# EAGLE design esparducam (EAGLE 6.5.0)
CNAME: A two component webcam; CREVISION: 1; DESIGNER: Johan Kanflo
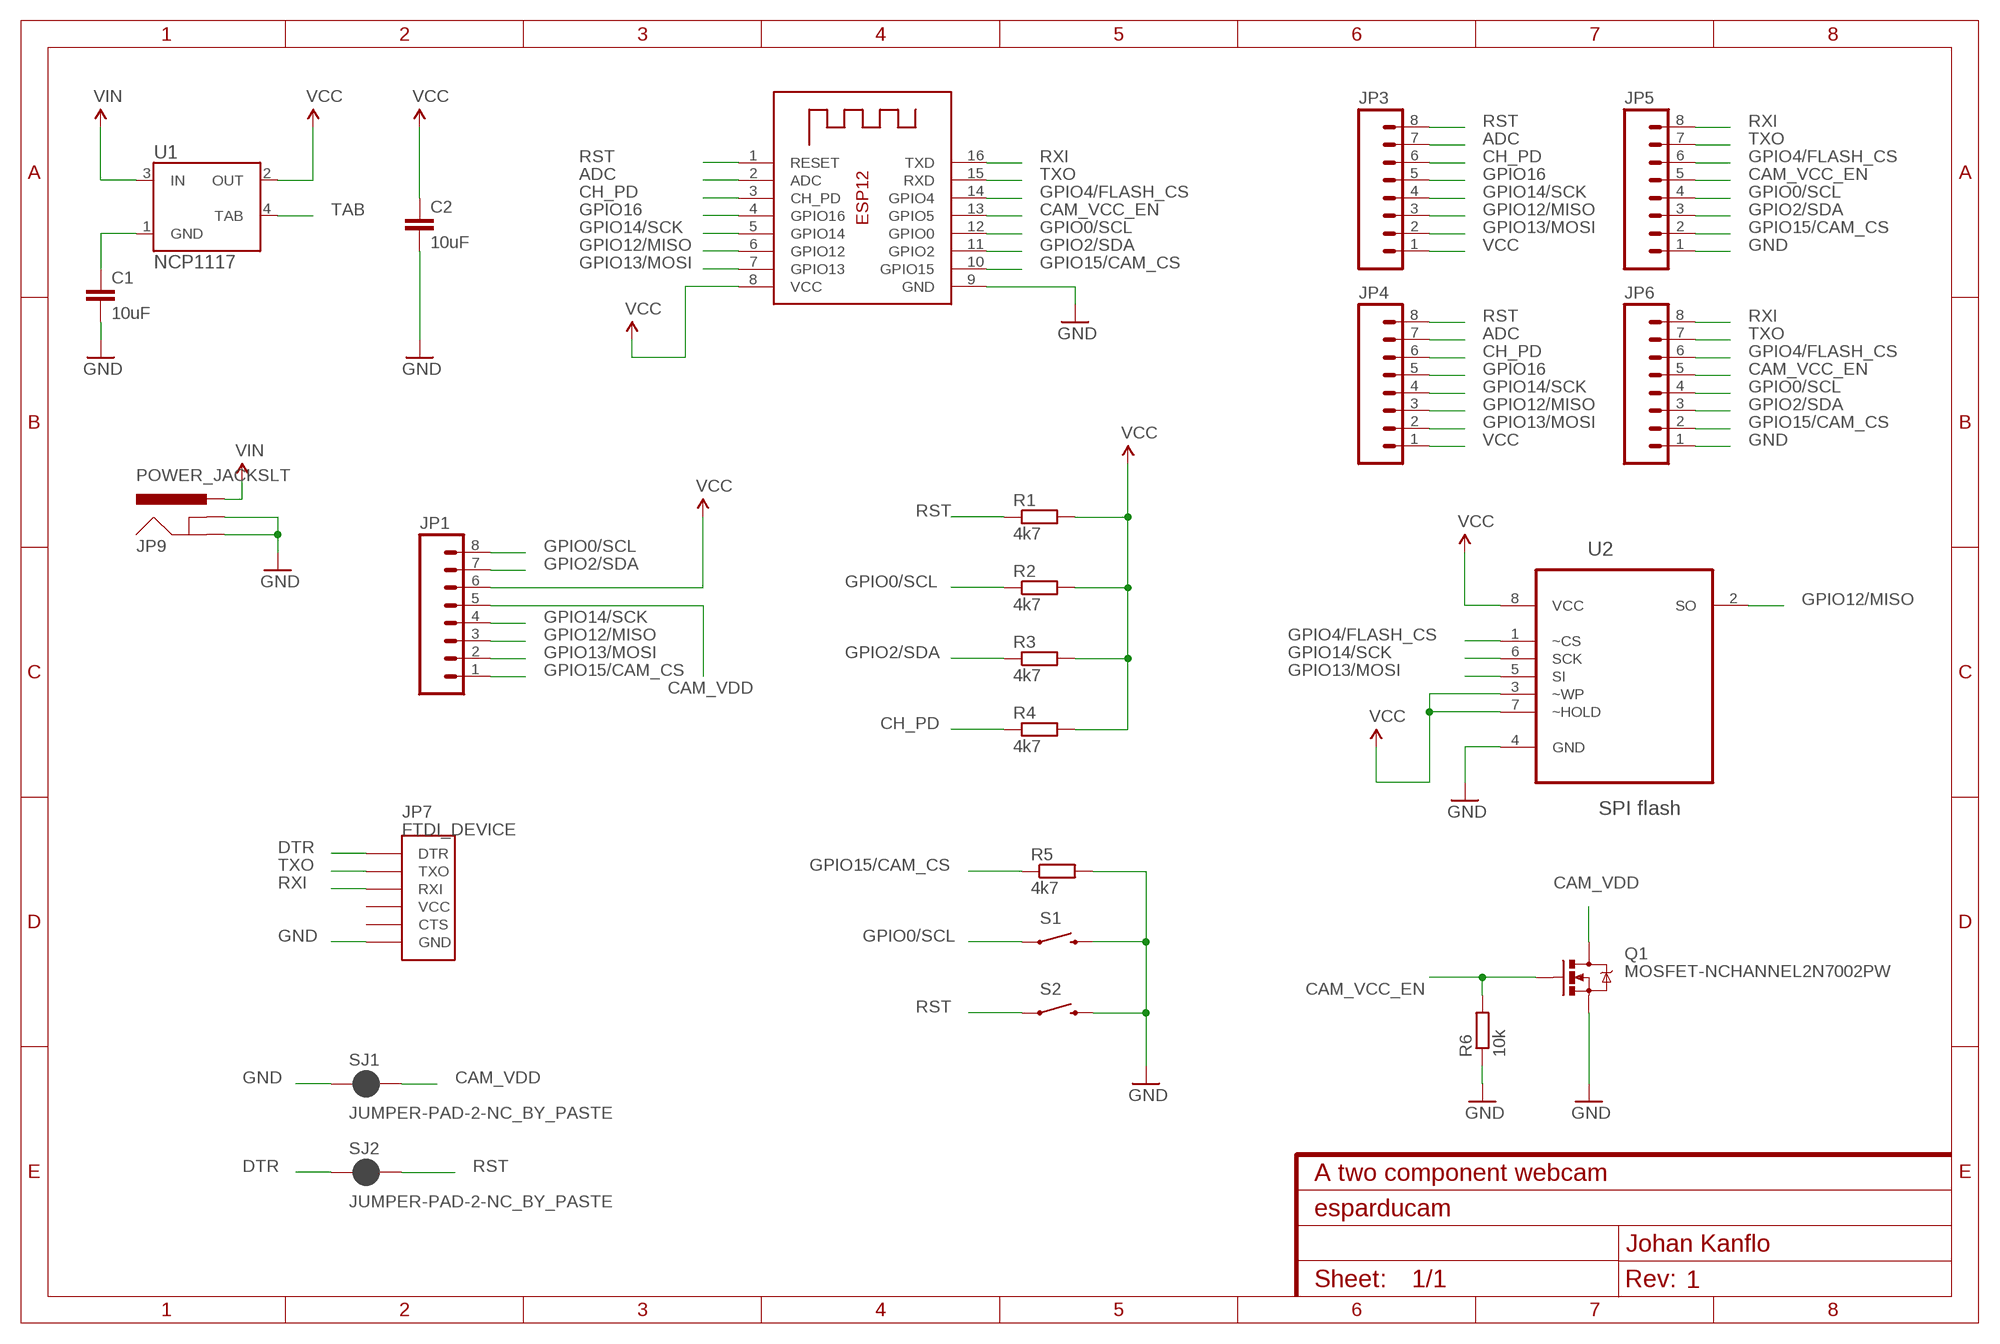
[diagram p0: schematic, sheet 1]

## Parts
C1  10uF  CAP0603-CAP  [0603-CAP]
C2  10uF  CAP0603-CAP  [0603-CAP]
JP1  M08  [1X08_ROUND]
JP3  M08  [1X08_ROUND]
JP4  M08  [1X08_ROUND]
JP5  M08  [1X08_ROUND]
JP6  M08  [1X08_ROUND]
JP7  FTDI_DEVICE  [FTDI_DEVICE_SIDE]
JP9  POWER_JACKSLT  [POWER_JACK_SLOT]
Q1  MOSFET-NCHANNEL2N7002PW  [SOT323]
R1  4k7  R-EU_R0603  [R0603]
R2  4k7  R-EU_R0603  [R0603]
R3  4k7  R-EU_R0603  [R0603]
R4  4k7  R-EU_R0603  [R0603]
R5  4k7  R-EU_R0603  [R0603]
R6  10k  R-EU_R0603  [R0603]
S1  SWITCH-MOMENTARY-2SMD-1101NE  [TACTILE-SWITCH-1101NE]
S2  SWITCH-MOMENTARY-2SMD-1101NE  [TACTILE-SWITCH-1101NE]
SJ1  JUMPER-PAD-2-NC_BY_PASTE  [PAD-JUMPER-2-NC_BY_PASTE_YES_SILK]
SJ2  JUMPER-PAD-2-NC_BY_PASTE  [PAD-JUMPER-2-NC_BY_PASTE_YES_SILK]
U1  NCP1117  [SOT223]
U2  SPI flash  AT25DF021-SSH-B  [SOIC127P600X175-8N]
X1  ESP-12  [ESP-12]

## Nets
ADC: JP3.7 JP4.7 X1.2(ADC)
CAM_VCC_EN: JP5.5 JP6.5 Q1.1(G) R6.2 X1.13(GPIO5)
CAM_VDD: JP1.5 Q1.3(D) SJ1.2
CH_PD: JP3.6 JP4.6 R4.1 X1.3(CH_PD)
DTR: JP7.P$1(DTR) SJ2.1
GND: C1.2 C2.2 JP5.1 JP6.1 JP7.P$6(GND) JP9.GND@1(GNDBREAK) JP9.GND@2(GND) Q1.2(S) R5.2 R6.1 S1.2 S2.2 SJ1.1 U2.4(GND) X1.9(GND)
GPIO0/SCL: JP1.8 JP5.4 JP6.4 R2.1 S1.1 X1.12(GPIO0)
GPIO2/SDA: JP1.7 JP5.3 JP6.3 R3.1 X1.11(GPIO2)
GPIO4/FLASH_CS: JP5.6 JP6.6 U2.1(~CS) X1.14(GPIO4)
GPIO12/MISO: JP1.3 JP3.3 JP4.3 U2.2(SO) X1.6(GPIO12)
GPIO13/MOSI: JP1.2 JP3.2 JP4.2 U2.5(SI) X1.7(GPIO13)
GPIO14/SCK: JP1.4 JP3.4 JP4.4 U2.6(SCK) X1.5(GPIO14)
GPIO15/CAM_CS: JP1.1 JP5.2 JP6.2 R5.1 X1.10(GPIO15)
GPIO16: JP3.5 JP4.5 X1.4(GPIO16)
N$11: C1.1 U1.1(GND)
RST: JP3.8 JP4.8 R1.1 S2.1 SJ2.2 X1.1(RESET)
RXI: JP5.8 JP6.8 JP7.P$3(RXI) X1.16(TXD)
TAB: U1.4(TAB)
TXO: JP5.7 JP6.7 JP7.P$2(TXO) X1.15(RXD)
VCC: C2.1 JP1.6 JP3.1 JP4.1 R1.2 R2.2 R3.2 R4.2 U1.2(OUT) U2.3(~WP) U2.7(~HOLD) U2.8(VCC) X1.8(VCC)
VIN: JP9.PWR U1.3(IN)
Unconnected: JP7.P$4(VCC) JP7.P$5(CTS)

## Library data of the parts
C1 C2 = SparkFun-Capacitors:CAP: Capacitor Standard 0603 ceramic capacitor, and 0.1" leaded capacitor.
JP1 JP3-JP6 = SparkFun-Connectors:M08: Header 8 Standard 8-pin 0.1" header. Use with straight break away headers (SKU : PRT-00116), right angle break away headers (PRT-00553), swiss pins (PRT-00743), machine pins (PRT-00117), and female headers (PRT-00115).
JP7 = SparkFun-Connectors:FTDI_DEVICE: Connector which mates to FTDI basic or FTDI cable.
JP9 = SparkFun-Connectors:POWER_JACK: Power Jack This is the standard 5.5mm barrel jack for power. The PTH is the most common, proven, reliable, footprint. The Slot footprint only works if the mill layer is transmitted to the PCB fab house so be warned. Mating wall wart : TOL-00298 (and others); PROD_ID: PRT-00119
Q1 = SparkFun-DiscreteSemi:MOSFET-NCHANNEL: Common NMOSFET Parts MFG P/N Store ID Prod ID FDD8780 TRANS-09984 SI7820DN TRANS-11055 FDS6630A IC-08089 2N7002PW TRANS-11151 FQP30N06L COM-10213 TRANS-10060 BSS123LT1G TRANS-08345 BSS138 TRANS-00830 BS170 2N7000; PROD_ID: TRANS-11151
R1-R6 = resistor:R-EU_: RESISTOR, European symbol
S1 S2 = SparkFun-Electromechanical:SWITCH-MOMENTARY-2: Various NO switches- pushbuttons, reed, etc; PROD_ID: SWCH-00815
SJ1 SJ2 = SparkFun-Passives:JUMPER-PAD-2-NC_BY_PASTE
U1 = ELL-i-PowerIC:NCP1117
U2 = Atmel_By_element14_Batch_1-00:AT25DF021-SSH-B: 2-Megabit Minimum SPI Serial Flash Memory; MPN: AT25DF021-SSH-B; OC_FARNELL: 1715438; OC_NEWARK: 15R0303; PACKAGE: SOIC-8; SUPPLIER: Atmel
X1 = adafruit:ESP-12

## Board
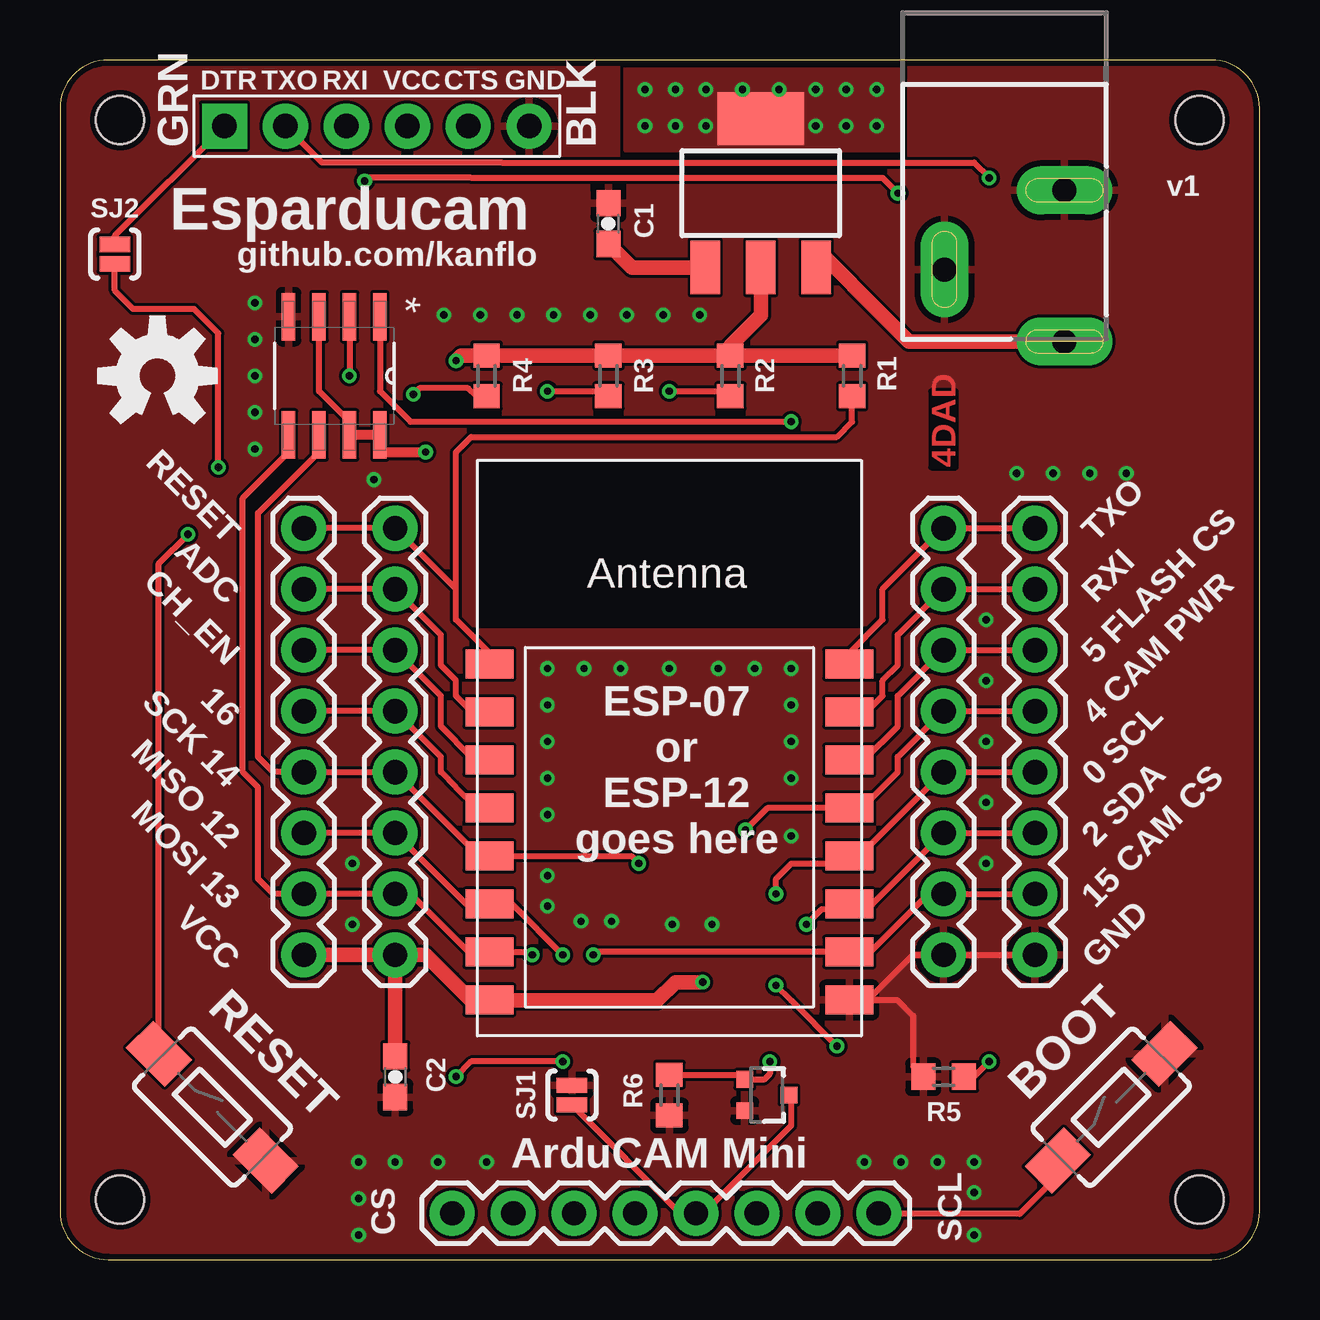
[diagram p1: board, top side]
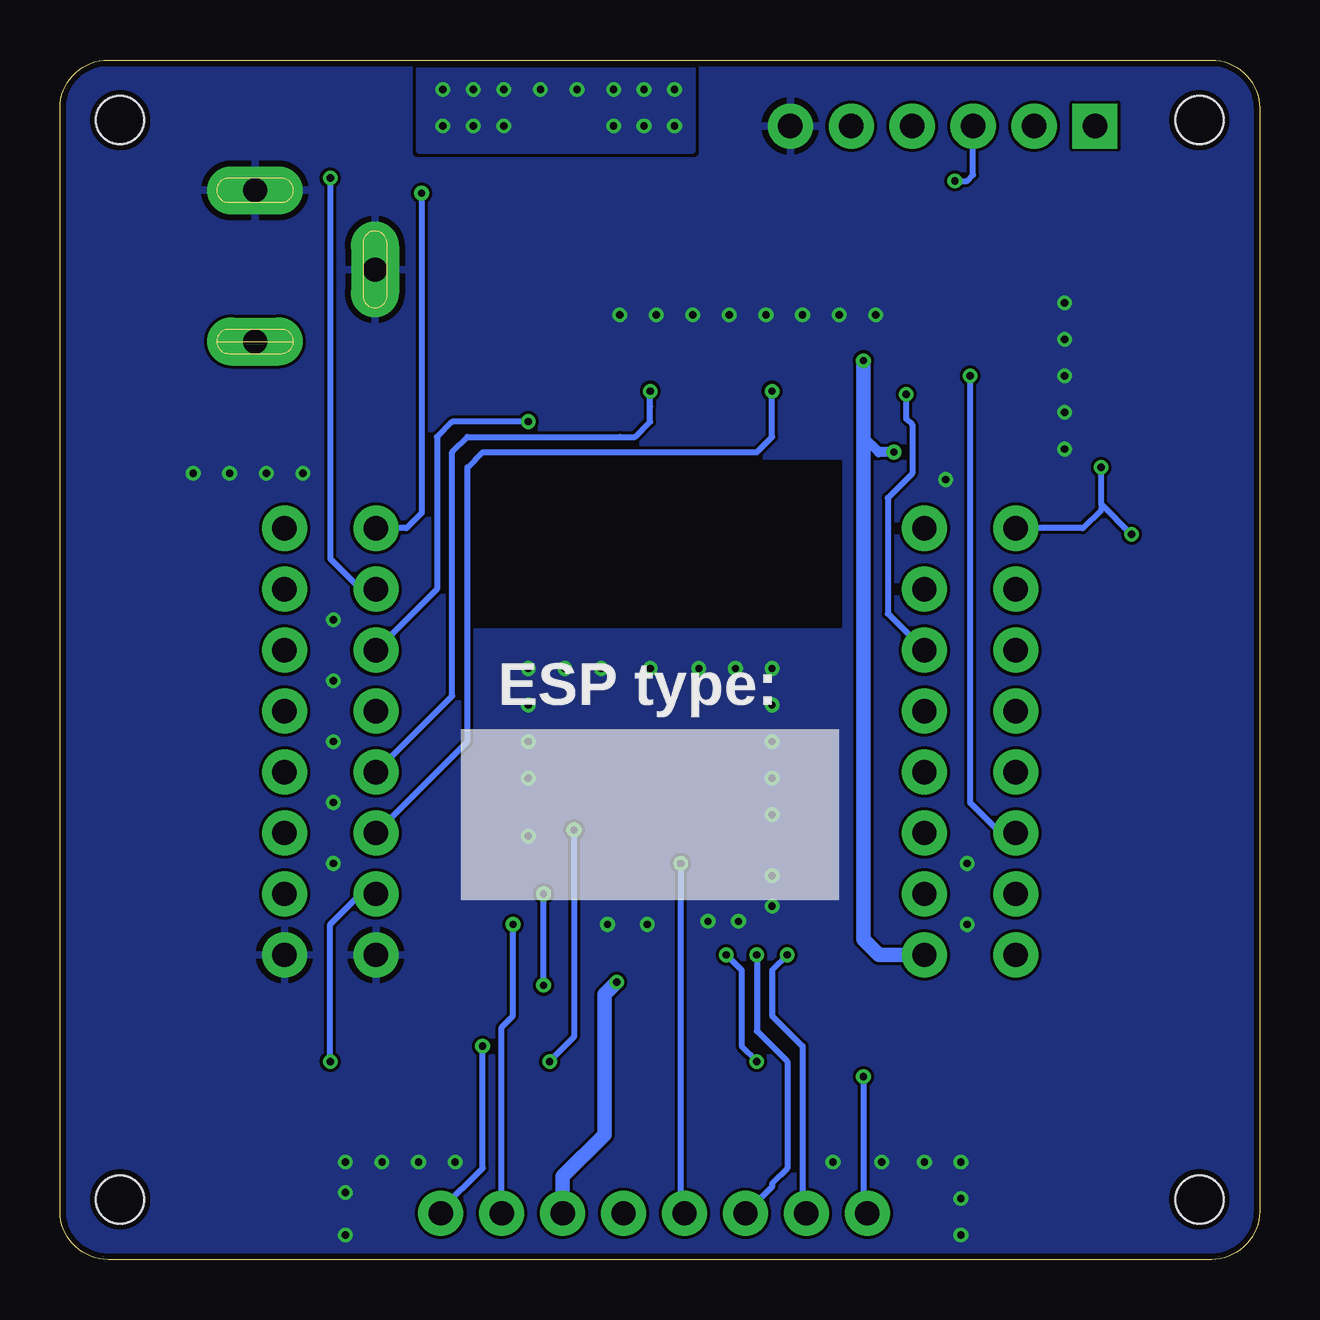
[diagram p2: board, bottom side, seen from below]

Size 50 x 50 mm. Coordinates in mm from the lower left corner, seen from the top.
Outline: 50,2 50,48 arc90 48,50 2,50 arc90 0,48 0,2 arc90 2,0 48,0 arc90 50,2
Copper layers (1*16): Top 0.035mm / dielectric 1.5mm / Bottom 0.035mm
Design rules "dirt_cheap_dirty_boards.v1": minimum track width 5mil, minimum drill 12mil, track to track 5mil, track to pad 5mil, pad to pad 5mil, via to via 5mil, smd to smd 0mil, copper to edge 10mil, drill to drill 10mil, minimum pad ring 10mil, minimum via ring 6mil, stop-mask expansion 2mil, vias tented up to drill 25mil, thermal gap 10mil
Holes 2 mm at 47.49,47.49 47.49,2.51 2.51,2.51 2.51,47.49

### Footprints (pad centres in the part's own frame; a part is rotated, then mirrored left to right if it is on the bottom)
0603-CAP = smd 1.1 x 1: 1 -0.85,0; 2 0.85,0
1X08_ROUND = drill 1.016 pad 1.88: 1 0,0; 2 2.54,0; 3 5.08,0; 4 7.62,0; 5 10.16,0; 6 12.7,0; 7 15.24,0; 8 17.78,0
FTDI_DEVICE_SIDE = drill 1.016 pad 1.88 square: P$1 -6.35,0 | drill 1.016 pad 1.88: P$2 -3.81,0; P$3 -1.27,0; P$4 1.27,0; P$5 3.81,0; P$6 6.35,0
POWER_JACK_SLOT = drill 1 pad 2 long: GND@1 2.58,7.5; GND@2 7.58,10.8; PWR 2.58,13.8
SOT323 = smd 0.7 x 0.7: 1 -0.65,-0.925; 2 0.65,-0.925; 3 0,0.925
R0603 = smd 1 x 1.1: 1 -0.85,0; 2 0.85,0
TACTILE-SWITCH-1101NE = smd 2.3 x 1.6: 1 -3.15,0; 2 3.15,0
PAD-JUMPER-2-NC_BY_PASTE_YES_SILK = smd 0.635 x 1.27: 1 -0.401,0; 2 0.413,0
SOT223 = smd 1.219 x 2.235: 1 -2.311,-3.099; 2 0,-3.099; 3 2.311,-3.099 | smd 3.6 x 2.2: 4 0,3.099
SOIC127P600X175-8N = smd 1.981 x 0.559: 1 -2.464,1.905; 2 -2.464,0.635; 3 -2.464,-0.635; 4 -2.464,-1.905; 5 2.464,-1.905; 6 2.464,-0.635; 7 2.464,0.635; 8 2.464,1.905
ESP-12 = smd 2 x 1.2: 1 -7.5,4.5; 2 -7.5,2.5; 3 -7.5,0.5; 4 -7.5,-1.5; 5 -7.5,-3.5; 6 -7.5,-5.5; 7 -7.5,-7.5; 8 -7.5,-9.5; 9 7.5,-9.5; 10 7.5,-7.5; 11 7.5,-5.5; 12 7.5,-3.5; 13 7.5,-1.5; 14 7.5,0.5; 15 7.5,2.5; 16 7.5,4.5

### Placement (x,y rotation side)
C1  22.86,43.18 90 top
C2  13.97,7.62 270 top
JP1  16.35,1.93 0 top
JP3  10.16,12.7 90 top
JP4  13.97,12.7 90 top
JP5  36.83,12.7 90 top
JP6  40.64,12.7 90 top
JP7  13.21,47.24 0 top
JP9  44.45,52.07 180 top
Q1  29.46,6.86 270 top
R1  33.02,36.83 90 top
R2  27.94,36.83 90 top
R3  22.86,36.83 90 top
R4  17.78,36.83 90 top
R5  36.83,7.62 180 top
R6  25.4,6.86 90 top
S1  43.81,6.35 45 top
S2  6.35,6.35 315 top
SJ1  21.34,6.86 270 top
SJ2  2.29,41.91 270 top
U1  29.21,44.45 0 top
U2  11.43,36.83 270 top
U$1  [OSHW-LOGO-M]  4.06,36.83 0 top
X1  25.4,20.32 0 top

### Tracks (layer width: path | path; a pad name or v marks a point on that pad's centre or on a via)
ADC
  Top 0.254: X1.2 17.18,22.82 16.51,23.5 16.51,24.13 15.88,24.77 15.88,26.04 JP4.7 JP3.7
CAM_VCC_EN  (via drill 0.3 pad 0.25)
  Top 0.254: JP6.5 JP5.5 34.92,20.95 34.92,20.32 33.42,18.82 X1.13 29.49,18.82 v28.57,17.91 | R6.2 28.34,7.71 Q1.1 28.55,7.49 29.34,7.49 29.59,7.75 v29.59,8.26
  Bottom 0.254: v28.57,17.91 28.57,9.27 v29.59,8.26
CAM_VDD
  Top 0.254: Q1.3 30.48,6.77 30.48,5.59 26.82,1.93 JP1.5 25.85,1.93 SJ1.2
CH_PD  (via drill 0.3 pad 0.25)
  Top 0.254: X1.3 17.9,20.84 17.78,20.95 17.14,20.95 15.88,22.23 15.88,23.5 JP4.6 JP3.6 | R4.1 17.36,35.98 17.02,36.32 14.99,36.32 v14.73,36.07
  Bottom 0.254: v14.73,36.07 14.73,35.05 14.48,34.8 14.48,32.77 15.49,31.75 15.49,26.92 JP4.6
DTR
  Top 0.254: SJ2.1 2.29,42.67 JP7.P$1
GND  (via drill 0.3 pad 0.25)
  Top 0.254: X1.9 33.68,10.82 | 33.68,10.82 35.56,12.7 JP5.1 JP6.1 | 33.68,10.82 34.9,10.82 35.56,10.16 35.56,8.04 R5.2
  other vias: 12.45,1.02 42.93,32.77 12.45,2.54 13.97,4.06 15.75,4.06 17.78,4.06 12.45,4.06 38.1,2.79 33.53,4.06 35.05,4.06 44.45,32.77 36.58,4.06 38.1,4.06 38.1,1.02 20.32,14.73 20.32,16 25.53,13.97 17.53,39.37 30.48,17.65 20.32,18.54 20.32,20.07 20.32,21.59 20.32,23.11 20.32,24.64 12.19,16.51 12.19,13.97 21.72,14.1 22.99,14.1 41.4,32.77 27.18,13.97 25.15,39.37 39.88,32.77 30.48,20.07 30.48,21.59 30.48,23.11 30.48,24.64 19.05,39.37 20.57,39.37 28.96,24.64 21.84,24.64 23.62,39.37 23.37,24.64 25.4,24.64 27.43,24.64 22.1,39.37 8.13,39.88 8.13,33.78 16,39.37 8.13,38.35 8.13,36.83 8.13,35.31 38.61,26.67 38.61,24.13 38.61,21.59 38.61,19.05 38.61,16.51 26.67,39.37 13.08,32.51
  pour Top (rank 6): 0,48.04 0,2 arc90 2,0 48.04,0 arc90 50.04,2 50.04,48.04 arc90 48.04,50.04 2,50.04 arc90
  pour Bottom (rank 6): 0,48.04 0,2 arc90 2,0 48.04,0 arc90 50.04,2 50.04,48.04 arc90 48.04,50.04 2,50.04 arc90
GPIO0/SCL  (via drill 0.3 pad 0.25)
  Top 0.254: JP6.4 JP5.4 33.33,16.82 X1.12 32.59,16.51 30.48,16.51 29.84,15.88 v29.84,15.24 | v32.38,8.89 30.48,10.79 v29.84,11.43 | S1.1 41.59,3.49 40.01,1.91 34.15,1.91 JP1.8 | v25.4,36.2 27.73,36.2 R2.1
  Bottom 0.254: JP1.8 34.13,2.07 32.38,3.81 v32.38,8.89 | v29.84,11.43 v29.84,15.24 | JP5.4 34.29,22.86 33.66,23.5 33.66,33.66 33.02,34.29 26.67,34.29 26.04,34.29 25.4,34.92 25.4,35.56 v25.4,36.2
GPIO2/SDA  (via drill 0.3 pad 0.25)
  Top 0.254: JP6.3 JP5.3 33.87,14.82 X1.11 32.69,14.61 31.75,14.61 v31.11,13.97 | v20.32,36.2 22.64,36.2 R3.1
  Bottom 0.254: JP1.7 31.59,9.69 31.11,10.16 v31.11,13.97 | JP5.3 33.02,21.59 33.02,33.02 32.38,33.66 20.95,33.66 20.32,34.29 v20.32,36.2
GPIO4/FLASH_CS  (via drill 0.3 pad 0.25)
  Top 0.254: X1.14 33.52,20.82 34.92,22.23 34.92,23.5 JP5.6 JP6.6 | U2.1 13.34,36.2 14.61,34.92 v30.48,34.92
  Bottom 0.254: v30.48,34.92 33.66,34.92 34.29,34.29 34.29,27.94 JP5.6
GPIO12/MISO  (via drill 0.3 pad 0.25)
  Top 0.254: JP3.3 JP4.3 16.93,14.82 X1.6 18.84,14.82 v20.95,12.7 | U2.2 v12.06,36.83
  Bottom 0.254: v12.06,36.83 12.06,19.05 10.79,17.78 JP3.3 | v20.95,12.7 20.95,9.53 19.68,8.26 19.68,3.81 20.32,3.17 20.32,3.04 JP1.3
GPIO13/MOSI  (via drill 0.3 pad 0.25)
  Top 0.254: U2.5 9.53,33.66 8.26,32.38 7.62,31.75 7.62,20.32 8.26,19.68 8.26,15.88 8.89,15.24 JP3.2 JP4.2 14.61,15.24 17.02,12.82 X1.7 19.57,12.82 v19.68,12.7
  Bottom 0.254: v19.68,12.7 20.32,12.06 20.32,10.16 19.05,8.89 19.05,2.09 JP1.2
GPIO14/SCK  (via drill 0.3 pad 0.25)
  Top 0.254: U2.6 10.79,33.66 9.53,32.38 8.26,31.11 8.26,20.95 8.89,20.32 JP3.4 JP4.4 17.47,16.82 X1.5 23.82,16.82 v24.13,16.51
  Bottom 0.254: v24.13,16.51 24.13,2.09 JP1.4
GPIO15/CAM_CS  (via drill 0.3 pad 0.25)
  Top 0.254: JP6.2 JP5.2 36.2,15.24 33.77,12.82 X1.10 22.34,12.82 v22.23,12.7 | v20.95,8.26 17.14,8.26 v16.51,7.62 | R5.1 38.1,7.62 v38.73,8.26
  Bottom 0.254: v22.23,12.7 21.59,12.06 21.59,8.89 v20.95,8.26 | v16.51,7.62 16.51,2.09 JP1.1 | v38.73,8.26 38.73,13.97 37.47,15.24 JP5.2
GPIO16
  Top 0.254: X1.4 17.38,18.82 16.51,19.68 15.88,20.32 15.88,20.95 JP4.5 JP3.5
N$11
  Top 0.61: U1.1 23.84,41.35 C1.1
RST  (via drill 0.3 pad 0.25)
  Top 0.254: JP3.8 JP4.8 16.51,27.94 | X1.1 17.9,25.28 16.51,26.67 16.51,27.3 16.51,27.94 | 16.51,27.94 16.51,33.66 17.14,34.29 32.38,34.29 33.02,34.92 R1.1 | S2.1 4.12,29.02 v5.33,30.23 | v6.6,33.02 6.6,38.61 5.59,39.62 3.05,39.62 2.29,40.39 SJ2.2
  Bottom 0.254: 6.6,31.5 6.6,31.24 7.37,30.48 JP3.8 | v5.33,30.23 6.6,31.5 | 6.6,31.5 v6.6,33.02
RXI  (via drill 0.3 pad 0.25)
  Top 0.254: JP6.8 JP5.8 34.29,27.94 34.29,26.67 32.9,25.28 X1.16 | v34.92,44.45 34.29,45.09 17.14,45.09 12.83,45.09 v12.7,44.96
  Bottom 0.254: v34.92,44.45 34.92,31.11 35.56,30.48 JP5.8 | v12.7,44.96 12.19,44.96 11.94,45.21 JP7.P$3
TAB  (via drill 0.3 pad 0.25)
  other vias: 24.38,48.77 24.38,47.24 25.65,48.77 25.65,47.24 32.77,48.77 32.77,47.24 34.04,48.77 34.04,47.24 31.5,48.77 31.5,47.24 26.92,48.77 26.92,47.24 28.45,48.77 29.97,48.77
  pour Top (isolate 0.305, no thermals): 23.62,49.78 35.05,49.78 35.05,46.23 23.62,46.23
  pour Bottom (isolate 0.305, no thermals): 23.62,49.78 35.05,49.78 35.05,46.23 23.62,46.23
TXO  (via drill 0.3 pad 0.25)
  Top 0.254: X1.15 33.62,22.82 34.29,23.5 34.29,24.13 34.92,24.77 34.92,26.04 JP5.7 37.47,27.94 JP6.7 | v38.73,45.09 38.1,45.72 18.41,45.72 10.92,45.72 JP7.P$2
  Bottom 0.254: v38.73,45.09 38.73,29.21 38.1,28.57 37.47,27.94 JP5.7
VCC  (via drill 0.3 pad 0.25)
  Top 0.254: U2.7 12.06,34.92 10.79,36.2 U2.3
  Top 0.406: U2.7 U2.8 13.34,33.66 v15.24,33.66
  Top 0.61: U1.2 29.21,39.37 27.94,38.1 R2.2 | R1.2 R2.2 | R2.2 R3.2 R4.2 16.73,37.68 v16.51,37.47 | JP4.1 C2.1 | JP3.1 JP4.1 | JP4.1 15.24,12.7 17.12,10.82 X1.8 17.93,10.79 24.89,10.79 25.65,11.56 v26.8,11.56
  Bottom 0.406: v15.24,33.66 15.88,33.66 16.51,34.29
  Bottom 0.61: v16.51,37.47 16.51,34.29 16.51,13.34 15.88,12.7 JP4.1 | JP1.6 29.05,3.46 27.3,5.21 27.3,11.05 v26.8,11.56
VIN
  Top 0.61: JP9.PWR 35.39,38.27 34.29,39.37 31.75,41.91 31.75,41.58 U1.3

### Text on the board
Top: 4DAD
tNames: v1 | SJ2 | Esparducam | C1 | github.com/kanflo | R4 | R3 | R2 | R1 | RESET | TXO | ADC | RXI | CH_EN | 5 FLASH CS | 16 | 4 CAM PWR | SCK 14 | ESP-07 / or / ESP-12 / goes here | 0 SCL | MISO 12 | 2 SDA | MOSI 13 | 15 CAM CS | VCC | GND | RESET | C2 | BOOT | SJ1 | R6 | R5 | ArduCAM Mini | CS | SCL
bNames: ESP type: